# EAGLE schematic node_communication (EAGLE 7.3.0)
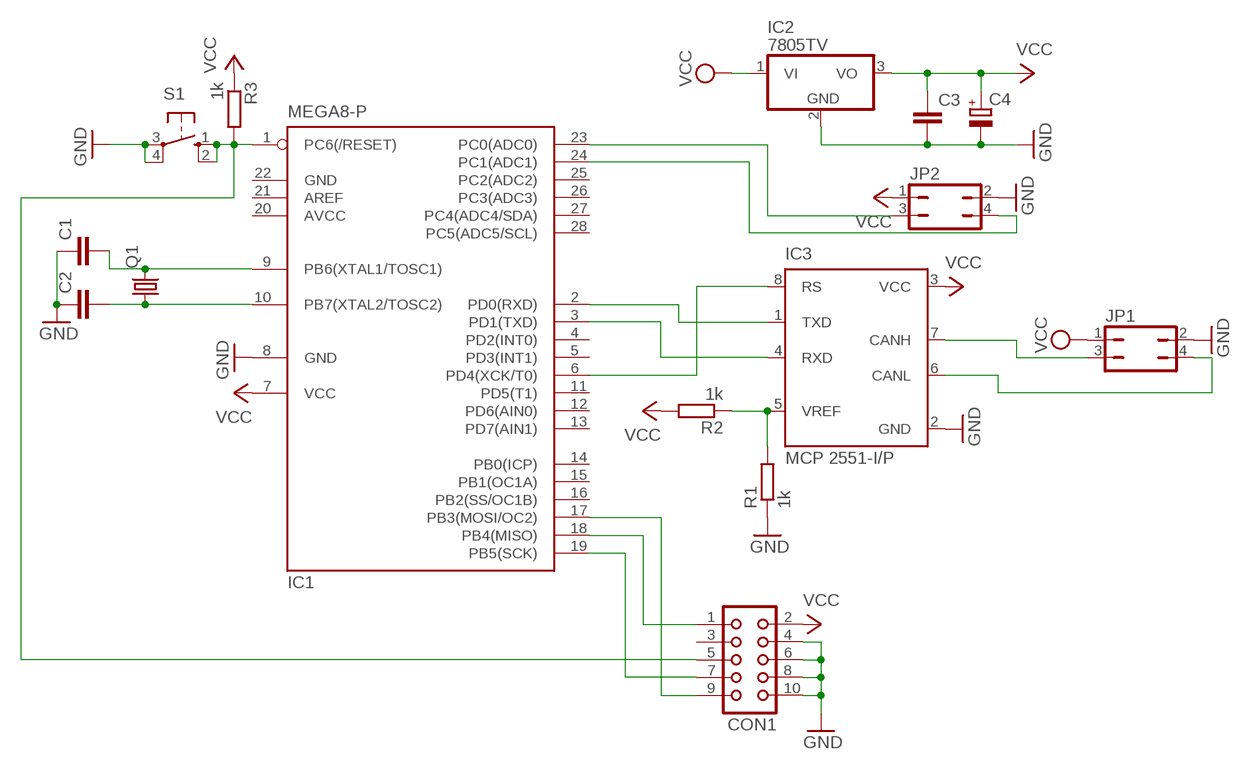
[diagram p0: schematic, sheet 1]

## Parts
C1  C2.5/2  [C2.5-2]
C2  C2.5/2  [C2.5-2]
C3  C2.5/2  [C2.5-2]
C4  CPOL-EUE2.5-6  [E2,5-6]
CON1  CON10  [CON10]
IC1  MEGA8-P  [DIL28-3]
IC2  7805TV  [TO220V]
IC3  MCP 2551-I/P  PCA82C250  [DIL08]
JP1  JP2Q  [JP2Q]
JP2  JP2Q  [JP2Q]
Q1  CRYSTALHC49S  [HC49/S]
R1  1k  R-EU_0207/2V  [0207/2V]
R2  1k  R-EU_0207/2V  [0207/2V]
R3  1k  R-EU_0207/2V  [0207/2V]
S1  10-XX  [B3F-10XX]

## Nets
GND: C1.1 C2.1 C3.2 C4.- CON1.4 CON1.6 CON1.8 CON1.10 IC1.8(GND) IC2.2(GND) IC3.2(GND) JP1.2 JP2.2 R1.1 S1.3(P) S1.4(P1)
N$1: C1.2 IC1.9(PB6(XTAL1/TOSC1)) Q1.2
N$2: C2.2 IC1.10(PB7(XTAL2/TOSC2)) Q1.1
N$3: IC3.5(VREF) R1.2 R2.1
N$4: CON1.5 IC1.1(PC6(/RESET)) R3.2 S1.1(S) S1.2(S1)
N$5: IC1.2(PD0(RXD)) IC3.1(TXD)
N$6: IC1.3(PD1(TXD)) IC3.4(RXD)
N$7: IC1.6(PD4(XCK/T0)) IC3.8(RS)
N$8: IC3.7(CANH) JP1.3
N$9: IC3.6(CANL) JP1.4
N$10: CON1.9 IC1.17(PB3(MOSI/OC2))
N$11: CON1.1 IC1.18(PB4(MISO))
N$12: CON1.7 IC1.19(PB5(SCK))
N$15: IC1.23(PC0(ADC0)) JP2.3
N$16: IC1.24(PC1(ADC1)) JP2.4
VCC: C3.1 C4.+ CON1.2 IC1.7(VCC) IC2.1(VI) IC2.3(VO) IC3.3(VCC) JP1.1 JP2.1 R2.2 R3.1
Unconnected: CON1.3 IC1.4(PD2(INT0)) IC1.5(PD3(INT1)) IC1.11(PD5(T1)) IC1.12(PD6(AIN0)) IC1.13(PD7(AIN1)) IC1.14(PB0(ICP)) IC1.15(PB1(OC1A)) IC1.16(PB2(SS/OC1B)) IC1.21(AREF) IC1.25(PC2(ADC2)) IC1.26(PC3(ADC3)) IC1.27(PC4(ADC4/SDA)) IC1.28(PC5(ADC5/SCL))

## Power pins joined to a net without a drawn wire
AVCC: IC1.20(AVCC)
GND: IC1.22(GND)

## Library data of the parts
C1-C3 = capacitor-wima:C: CAPACITOR naming: grid - package width
C4 = rcl:CPOL-EU: POLARIZED CAPACITOR, European symbol
CON1 = con-harting:CON10: CONNECTOR; OC_FARNELL: unknown; OC_NEWARK: unknown
IC1 = atmel:MEGA8-P: MICROCONTROLLER 8 Kbytes FLASH, 1 kbytes SRAM, 512 bytes EEPROM, USART, 4-channel 10 bit ADC, 2-channel 8 bit ADC Pin compatible with Atmega48, ATMega88, ATMega168 Source: avr.lbr; OC_FARNELL: unknown; OC_NEWARK: unknown
IC2 = linear:78*: Positive VOLTAGE REGULATOR Source: http://cache.national.com/ds/LM/LM78L05.pdf http://www.fairchildsemi.com/ds/LM/LM7805.pdf
IC3 = micro-philips:PCA82C250: CAN CONTROLLER INTERFACE; OC_FARNELL: 3692358; OC_NEWARK: unknown
JP1 JP2 = jumper:JP2Q: JUMPER
Q1 = crystal:CRYSTAL: CRYSTAL; OC_FARNELL: 1667008; OC_NEWARK: unknown
R1-R3 = rcl:R-EU_: RESISTOR, European symbol
S1 = switch-omron:10-XX: OMRON SWITCH; MPN: B3F-1000; OC_FARNELL: 176432; OC_NEWARK: 36M3542